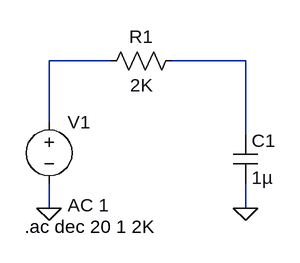
[diagram p0: schematic LOW PASS FILTER.asc]
LOW PASS FILTER.asc, the LTspice schematic file:
Version 4
SHEET 1 880 680
WIRE 112 48 32 48
WIRE 288 48 192 48
WIRE 32 128 32 48
WIRE 288 144 288 48
WIRE 32 240 32 208
WIRE 288 240 288 208
FLAG 32 240 0
FLAG 288 240 0
SYMBOL voltage 32 112 R0
WINDOW 123 24 124 Left 2
WINDOW 39 0 0 Left 0
SYMATTR InstName V1
SYMATTR Value ""
SYMATTR Value2 AC 1
SYMBOL res 208 32 R90
WINDOW 0 0 56 VBottom 2
WINDOW 3 32 56 VTop 2
SYMATTR InstName R1
SYMATTR Value 2K
SYMBOL cap 272 144 R0
SYMATTR InstName C1
SYMATTR Value 1µ
TEXT 0 264 Left 2 !.ac dec 20 1 2K

The netlist it stands for:
* LOW PASS FILTER.asc
V1 N001 0 AC 1
R1 N002 N001 2K
C1 N002 0 1µ
.ac dec 20 1 2K
.backanno
.end